# EAGLE design switch_board (EAGLE 9.1.3)
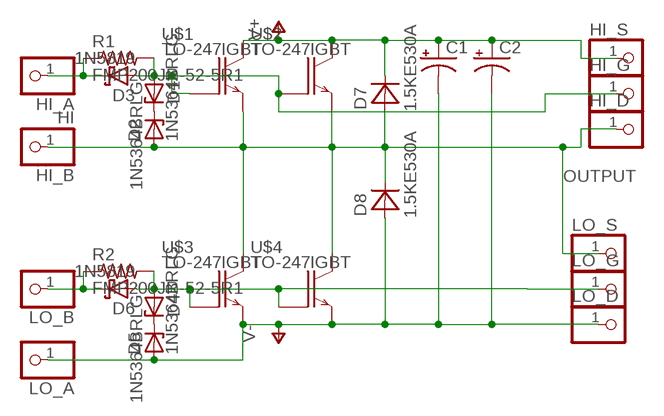
[diagram p0: schematic, sheet 1]

## Parts
C1  CPOL-USTAP5-45  [TAP5-45]
C2  CPOL-USTAP5-45  [TAP5-45]
D1  1N5364BRLG  [DIOAD1576W109L863D349B]
D2  1N5364BRLG  [DIOAD1576W109L863D349B]
D3  1N5819  [DIOAD1138W86L470D235B]
D4  1N5364BRLG  [DIOAD1576W109L863D349B]
D5  1N5364BRLG  [DIOAD1576W109L863D349B]
D6  1N5819  [DIOAD1138W86L470D235B]
D7  1.5KE530A  [DIOAD1631W107L835D505B]
D8  1.5KE530A  [DIOAD1631W107L835D505B]
HI_A  PINHD-1X1  [1X01]
HI_B  HI  PINHD-1X1  [1X01]
HI_D  PINHD-1X1  [1X01]
HI_G  PINHD-1X1  [1X01]
HI_S  PINHD-1X1  [1X01]
LO_A  PINHD-1X1  [1X01]
LO_B  PINHD-1X1  [1X01]
LO_D  PINHD-1X1  [1X01]
LO_G  PINHD-1X1  [1X01]
LO_S  PINHD-1X1  [1X01]
R1  FMP200JR-52-5R1  [RESAD1260W55L900D390B]
R2  FMP200JR-52-5R1  [RESAD1260W55L900D390B]
U$1  TO-247IGBT  [TO-247]
U$2  TO-247IGBT  [TO-247]
U$3  TO-247IGBT  [TO-247]
U$4  TO-247IGBT  [TO-247]

## Nets
N$1: D1.2(A) D3.2(A) HI_G.1 R1.2 U$1.G U$2.G
N$2: D1.1(C) D2.1(C)
N$4: D3.1(C) HI_A.1 R1.1
N$5: D4.2(A) D6.2(A) LO_G.1 R2.2 U$3.G U$4.G
N$8: D4.1(C) D5.1(C)
N$9: D6.1(C) LO_B.1 R2.1
OUTPUT: D2.2(A) D7.2(A) D8.1(C) HI_B.1 HI_D.1 LO_S.1 U$1.E U$2.E U$3.C U$4.C
V+: C1.+ C2.+ D7.1(C) HI_S.1 U$1.C U$2.C
V-: C1.- C2.- D5.2(A) D8.2(A) LO_A.1 LO_D.1 U$3.E U$4.E

## Library data of the parts
C1 C2 = resistor:CPOL-US: POLARIZED CAPACITOR, American symbol
D1 D2 D4 D5 = drsstc:1N5364BRLG
D3 D6 = drsstc:1N5819
D7 D8 = drsstc:1.5KE530A
HI_A HI_B HI_D HI_G HI_S LO_A LO_B LO_D LO_G LO_S = pinhead:PINHD-1X1: PIN HEADER
R1 R2 = drsstc:FMP200JR-52-5R1
U$1-U$4 = drsstc:TO-247IGBT

## Board
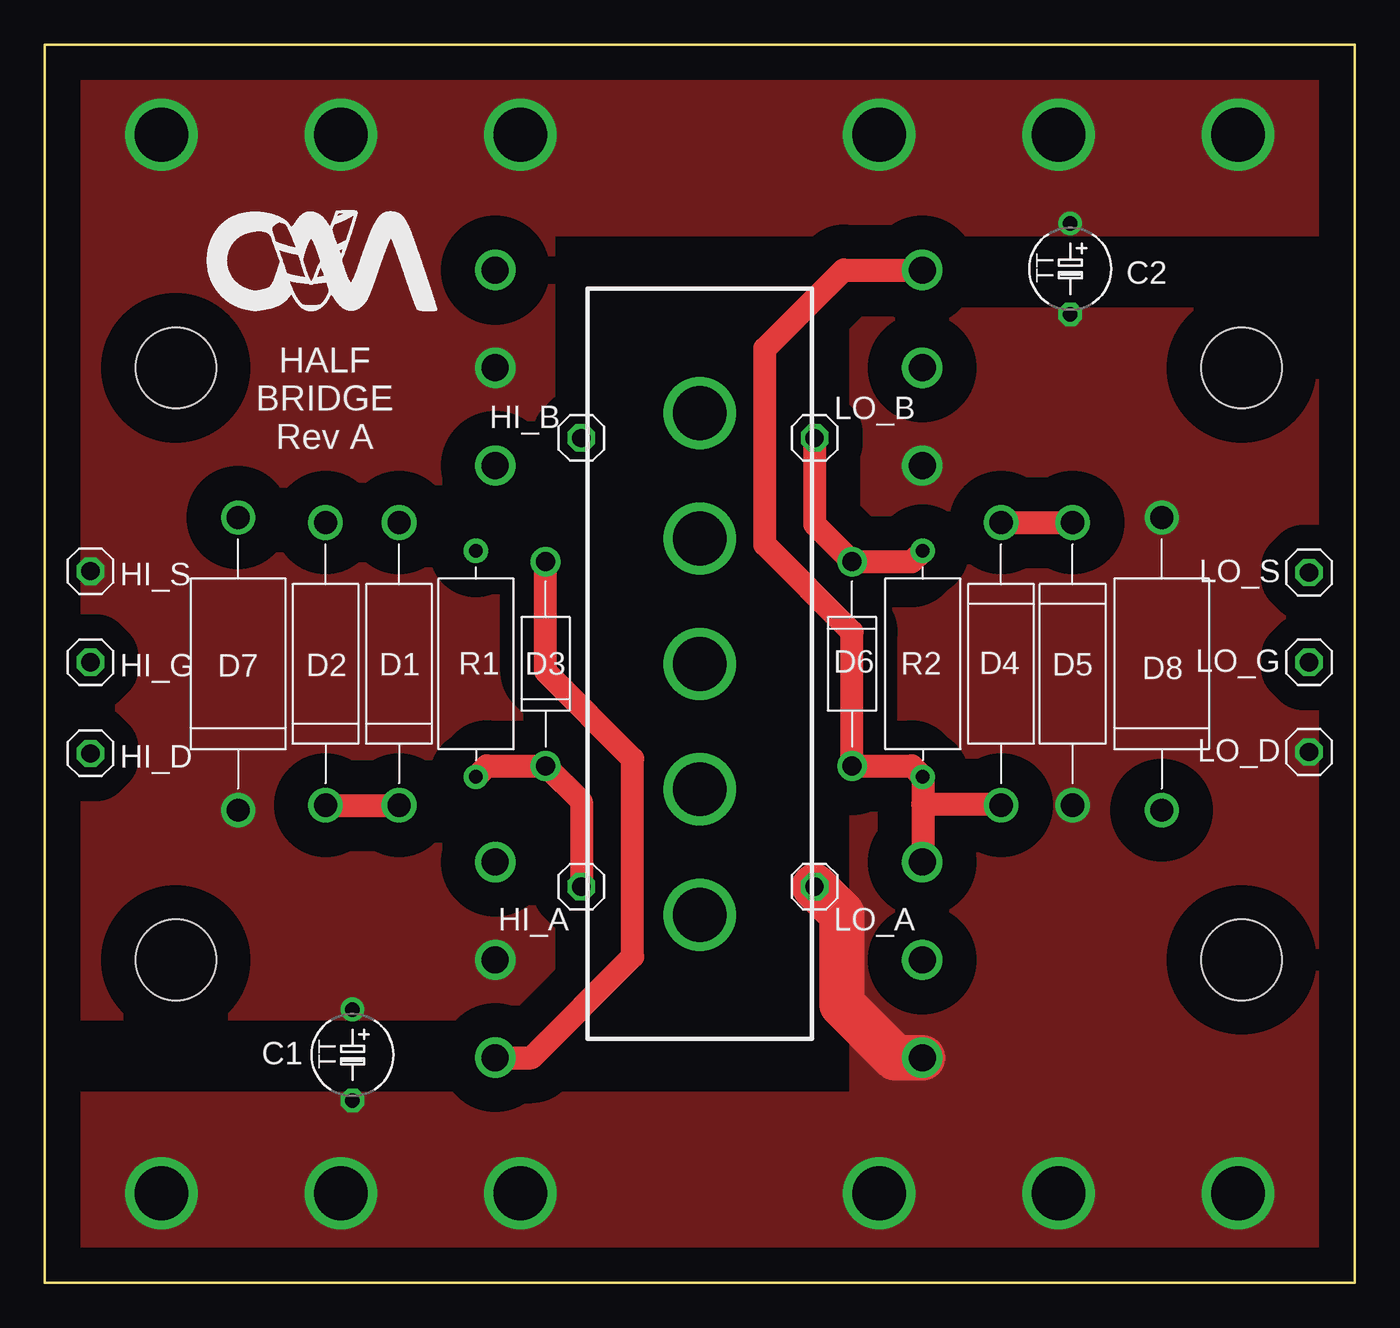
[diagram p1: board, top side]
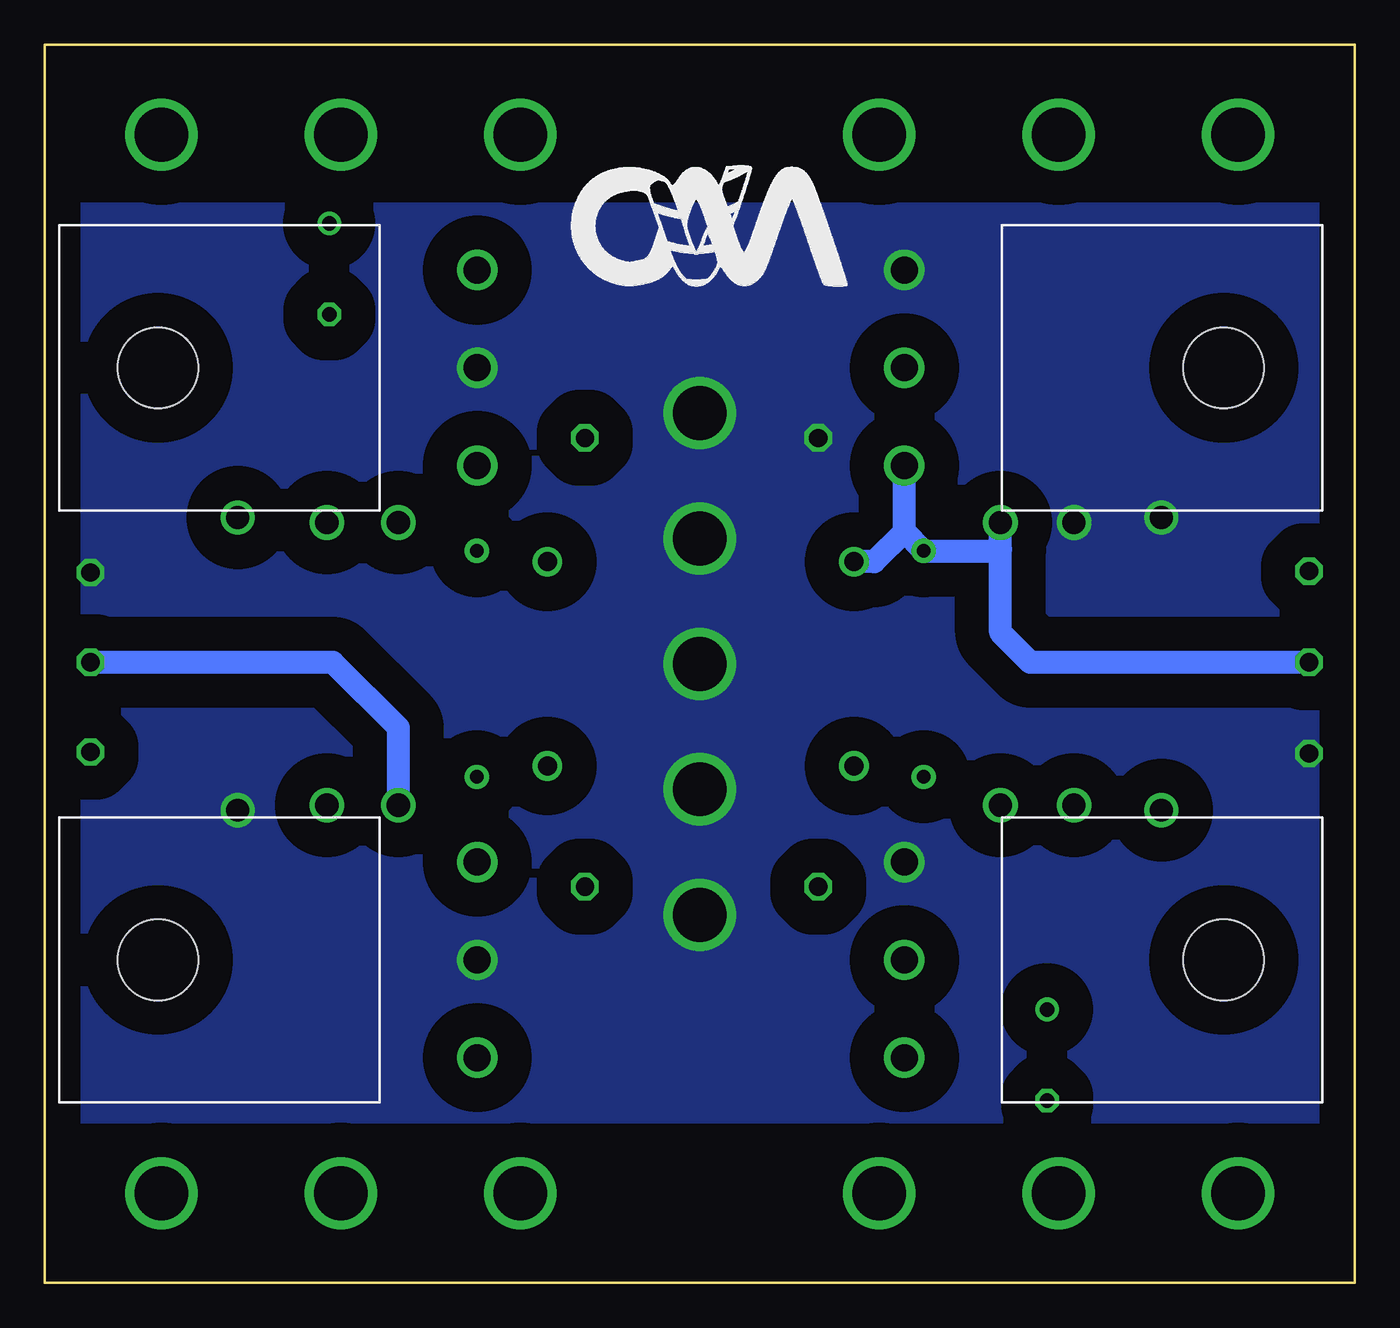
[diagram p2: board, bottom side, seen from below]

Size 73 x 69 mm. Coordinates in mm from the lower left corner, seen from the top.
Outline: 0,0 73,0 73,69 0,69 0,0
Copper layers (1*16): Top 0.035mm / dielectric 1.5mm / Bottom 0.035mm
Design rules "default": minimum track width 6mil, minimum drill 0.35mm, track to track 6mil, track to pad 6mil, pad to pad 6mil, via to via 6mil, smd to smd 6mil, copper to edge 40mil, drill to drill 6mil, minimum pad ring 10mil, minimum via ring 8mil, stop-mask expansion 4mil, vias tented up to drill 0mil, thermal gap 10mil

### Footprints (pad centres in the part's own frame; a part is rotated, then mirrored left to right if it is on the bottom)
TAP5-45 = drill 0.813: + -2.54,0 | drill 0.813 octagon: - 2.54,0
DIOAD1576W109L863D349B = drill 1.29 pad 1.935: 1 -7.88,0; 2 7.88,0
DIOAD1138W86L470D235B = drill 1.06 pad 1.66: 1 -5.69,0; 2 5.69,0
DIOAD1631W107L835D505B = drill 1.27 pad 1.905: 1 -8.155,0; 2 8.155,0
1X01 = drill 1.016 octagon: 1 0,0
RESAD1260W55L900D390B = drill 0.75 pad 1.35: 1 -6.3,0; 2 6.3,0
TO-247 = drill 1.5: C 0,0; E 0,5.45; G 0,-5.45 | hole 4.5: 17.8,0

### Placement (x,y rotation side)
C1  17.14,12.7 270 top
C2  57.15,56.52 270 top
D1  19.74,34.5 90 top
D2  15.64,34.5 90 top
D3  27.91,34.5 90 top
D4  53.3,34.5 270 top
D5  57.28,34.5 270 top
D6  44.99,34.5 270 top
D7  10.77,34.5 90 top
D8  62.25,34.5 90 top
HI_A  29.9,22.09 180 top
HI_B  29.9,47.09 180 top
HI_D  2.54,29.51 0 top
HI_G  2.54,34.59 0 top
HI_S  2.54,39.67 0 top
LO_A  42.9,22.09 180 top
LO_B  42.9,47.09 180 top
LO_D  70.46,29.59 0 top
LO_G  70.46,34.59 0 top
LO_S  70.46,39.59 0 top
R1  24.03,34.5 90 top
R2  48.93,34.5 270 top
U$1  25.1,18 0 bottom
U$2  25.1,51 0 bottom
U$3  48.9,51 180 bottom
U$4  48.9,18 180 bottom

### Tracks (layer width: path | path; a pad name or v marks a point on that pad's centre or on a via)
N$1
  Top 1.27: D3.2 27.91,34.06 32.77,29.21 32.77,18.18 27.13,12.55 U$1.G
  Bottom 1.27: HI_G.1 18.08,34.59 19.74,36.25 19.74,40.89 | 19.74,40.89 D1.2 | 19.74,40.89 19.83,40.8 R1.2 25.1,41.87 | 25.1,41.87 U$2.G | 25.1,41.87 26.78,40.19 D3.2
N$2
  Top 1.27: D2.1 D1.1
N$4
  Top 1.27: R1.1 24.64,28.81 D3.1 29.9,26.82 HI_A.1
N$5
  Top 1.27: U$3.G 44.51,56.45 40.13,52.07 40.13,41.15 44.99,36.29 D6.2 48.32,28.81 R2.2 48.93,26.67 | 48.93,26.67 48.93,23.48 U$4.G | D4.2 53.25,26.67 48.93,26.67
  Bottom 1.27: D4.2 53.3,30.94 56.94,34.59 LO_G.1
N$8
  Top 1.27: D4.1 D5.1
N$9
  Top 1.27: LO_B.1 42.9,42.29 D6.1 48.32,40.19 R2.1
OUTPUT  (via drill 3)
  other vias: 36.5,34.5 36.5,27.52 36.5,41.48 36.5,48.48 36.5,20.52
  pour Bottom (isolate 1.905, no thermals): 0.51,59.94 72.14,59.94 72.14,9.14 0.51,9.14
V+  (via drill 3)
  other vias: 6.5,64 16.5,64 26.5,64 46.5,64 56.5,64 66.5,64
  pour Top (isolate 1.905, no thermals): 0,69.09 72.9,69.09 72.9,58.55 28.19,58.55 28.19,14.86 0,14.86
V-  (via drill 3)
  Top 2.54: U$4.E 47.39,12.55 44.42,15.52 44.42,20.56 LO_A.1
  other vias: 6.5,5 16.5,5 26.5,5 46.5,5 56.5,5 66.5,5
  pour Top (isolate 1.905, no thermals): 0,0 72.9,0 72.9,54.23 44.96,54.23 44.96,11.94 44.96,10.54 0.76,10.54 0,10.54

### Text on the board
tPlace: HALF / BRIDGE / Rev A